# EAGLE schematic musicbox mechanical-04 (EAGLE 9.6.2)
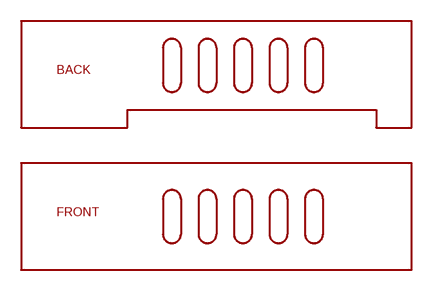
[diagram p0: schematic, sheet 1]

## Parts
U$1  LATTICE-FRONT  [LATTICE-FRONT]
U$2  LATTICE-BACK  [LATTICE-BACK]

## Library data of the parts
U$1 = music-box-parts:LATTICE-FRONT
U$2 = music-box-parts:LATTICE-BACK